# EAGLE design giraffe20_flipped (EAGLE 9.2.1)
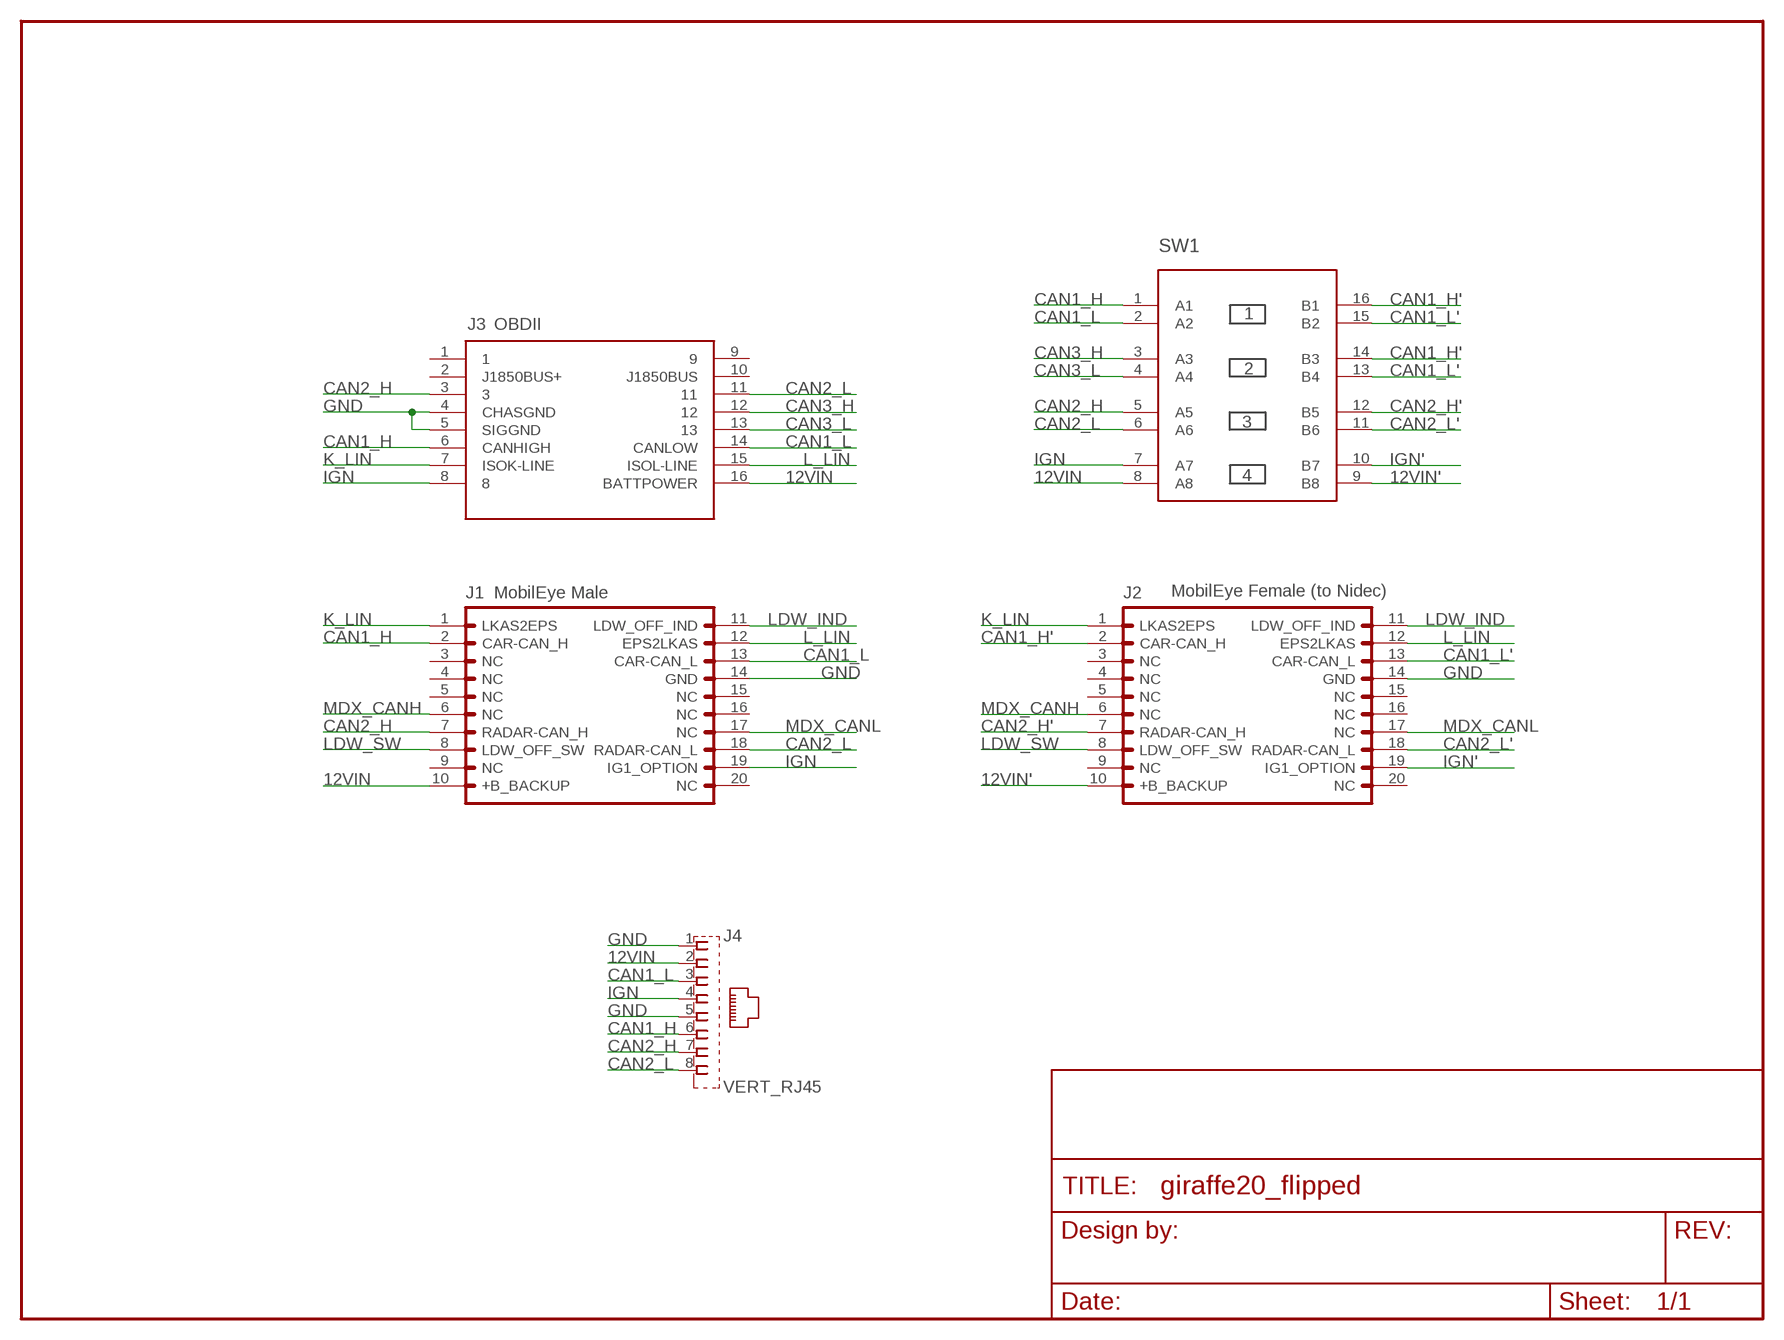
[diagram p0: schematic, sheet 1]

## Parts
FRAME1  FRAME-LETTERNO_PACKAGE  [DUMMY]
J1  MOBILEYERAMALE  [2X10(RA)]
J2  MOBILEYEFEMALE  [2X10(JAE_FEMALE)]
J3  OBDII-FEMALE-CUT  [OBDII-FEMALE-MIDCUT]
J4  VERT_RJ45  [GLX-S-88M]
SW1  4XDPSTSMT  [4-DPST]

## Nets
12VIN: J1.10(+B_BACKUP) J3.16(BATTPOWER) J4.2 SW1.8(A8)
12VIN': J2.10(+B_BACKUP) SW1.9(B8)
CAN1_H: J1.2(CAR-CAN_H) J3.6(CANHIGH) J4.6 SW1.1(A1)
CAN1_H': J2.2(CAR-CAN_H) SW1.14(B3) SW1.16(B1)
CAN1_L: J1.13(CAR-CAN_L) J3.14(CANLOW) J4.3 SW1.2(A2)
CAN1_L': J2.13(CAR-CAN_L) SW1.13(B4) SW1.15(B2)
CAN2_H: J1.7(RADAR-CAN_H) J3.3 J4.7 SW1.5(A5)
CAN2_H': J2.7(RADAR-CAN_H) SW1.12(B5)
CAN2_L: J1.18(RADAR-CAN_L) J3.11 J4.8 SW1.6(A6)
CAN2_L': J2.18(RADAR-CAN_L) SW1.11(B6)
CAN3_H: J3.12 SW1.3(A3)
CAN3_L: J3.13 SW1.4(A4)
GND: J1.14(GND) J2.14(GND) J3.4(CHASGND) J3.5(SIGGND) J4.1 J4.5
IGN: J1.19(IG1_OPTION) J3.8 J4.4 SW1.7(A7)
IGN': J2.19(IG1_OPTION) SW1.10(B7)
K_LIN: J1.1(LKAS2EPS) J2.1(LKAS2EPS) J3.7(ISOK-LINE)
L_LIN: J1.12(EPS2LKAS) J2.12(EPS2LKAS) J3.15(ISOL-LINE)
LDW_IND: J1.11(LDW_OFF_IND) J2.11(LDW_OFF_IND)
LDW_SW: J1.8(LDW_OFF_SW) J2.8(LDW_OFF_SW)
MDX_CANH: J1.6(NC) J2.6(NC)
MDX_CANL: J1.17(NC) J2.17(NC)
Unconnected: J1.3(NC) J1.4(NC) J1.5(NC) J1.9(NC) J1.15(NC) J1.16(NC) J1.20(NC) J2.3(NC) J2.4(NC) J2.5(NC) J2.9(NC) J2.15(NC) J2.16(NC) J2.20(NC) J3.1 J3.2(J1850BUS+) J3.9 J3.10(J1850BUS)

## Notes on the sheet
- OBDII
- MobilEye Male | MobilEye Female (to Nidec)

## Library data of the parts
FRAME1 = SparkFun-Aesthetics:FRAME-LETTER: Schematic Frame Standard 8.5x11 US Letter frame; DESIGNER: Nobody; VERSION: v01
J1 J2 = comma.ai:MOBILEYE: MobileEye connector for Acura ILX
J3 = comma.ai:OBDII-FEMALE
J4 = comma.ai:VERT_RJ45: Mod. Jack, Right Angle, 8 posiotion, 8 contatcs RJ45 Source: GLX-S-88M.pdf; OC_FARNELL: unknown; OC_NEWARK: unknown
SW1 = comma.ai:4XDPST

## Net classes
1 data: width 0.254 mm, clearance 0.254 mm

## Board
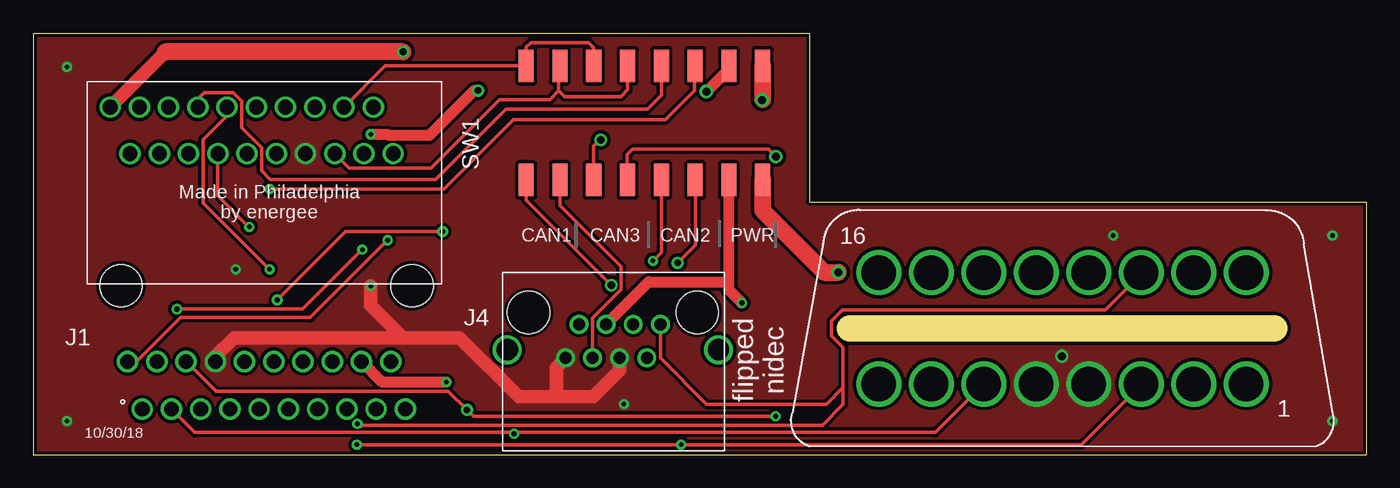
[diagram p1: board, top side]
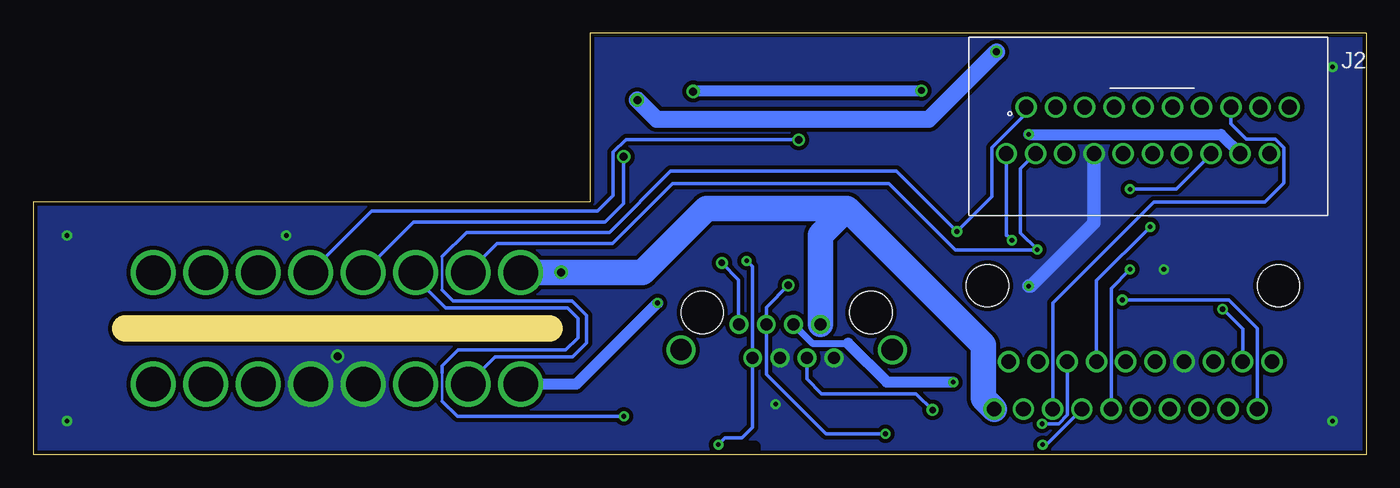
[diagram p2: board, bottom side, seen from below]

Size 100.33 x 31.75 mm. Coordinates in mm from the lower left corner, seen from the top.
Outline: 61.47,9.53 93.4,9.53
Outline: 0,31.75 58.42,31.75 58.42,19.05 100.33,19.05 100.33,0 0,0 0,31.75
Copper layers (1*16): Top 0.035mm / dielectric 1.5mm / Bottom 0.035mm
Design rules "default *": minimum track width 6mil, minimum drill 10mil, track to track 6mil, track to pad 6mil, pad to pad 6mil, via to via 6mil, smd to smd 6mil, copper to edge 10mil, drill to drill 10mil, minimum pad ring 10mil, minimum via ring 8mil, stop-mask expansion 4mil, vias tented up to drill 100mil, thermal gap 10mil
bRestrict: area 46,0.2 to 46.8,0.6

### Footprints (pad centres in the part's own frame; a part is rotated, then mirrored left to right if it is on the bottom)
2X10(RA) = drill 1.1 pad 1.422: 1 9.83,1.83; 2 7.63,1.83; 3 5.43,1.83; 4 3.23,1.83; 5 1.03,1.83; 6 -1.17,1.83; 7 -3.37,1.83; 8 -5.57,1.83; 9 -7.77,1.83; 10 -9.97,1.83; 11 10.93,-1.77; 12 8.73,-1.77; 13 6.53,-1.77; 14 4.33,-1.77; 15 2.13,-1.77; 16 -0.07,-1.77; 17 -2.27,-1.77; 18 -4.47,-1.77; 19 -6.67,-1.77; 20 -8.87,-1.77 | hole 3.2: -10.47,-7.47; 11.43,-7.47
2X10(JAE_FEMALE) = drill 1.1 pad 1.422: 1 -8.7,1.75; 2 -6.5,1.75; 3 -4.3,1.75; 4 -2.1,1.75; 5 0.1,1.75; 6 2.3,1.75; 7 4.5,1.75; 8 6.7,1.75; 9 8.9,1.75; 10 11.1,1.75; 11 -10.2,-1.75; 12 -8,-1.75; 13 -5.8,-1.75; 14 -3.6,-1.75; 15 -1.4,-1.75; 16 0.8,-1.75; 17 3,-1.75; 18 5.2,-1.75; 19 7.4,-1.75; 20 9.6,-1.75
OBDII-FEMALE-MIDCUT = drill 2.6 pad 3.4: 1 13.825,-4.2; 2 9.875,-4.2; 3 5.925,-4.2; 4 1.975,-4.2; 5 -1.975,-4.2; 6 -5.925,-4.2; 7 -9.875,-4.2; 8 -13.825,-4.2; 9 13.825,4.2; 10 9.875,4.2; 11 5.925,4.2; 12 1.975,4.2; 13 -1.975,4.2; 14 -5.925,4.2; 15 -9.875,4.2; 16 -13.825,4.2
GLX-S-88M = drill 0.9 pad 1.422: 1 -3.66,1.57; 2 -2.64,4.11; 3 -1.62,1.57; 4 -0.6,4.11; 5 0.42,1.57; 6 1.44,4.11; 7 2.46,1.57; 8 3.48,4.11 | drill 1.6 pad 2.184: S1 -8.04,2.2; S2 7.86,2.2 | hole 3.2: -6.44,5; 6.26,5
4-DPST = smd 1.13 x 2.44: 1 -8.89,-4.3; 2 -6.35,-4.3; 3 -3.81,-4.3; 4 -1.27,-4.3; 5 1.27,-4.3; 6 3.81,-4.3; 7 6.35,-4.3; 8 8.89,-4.3; 9 8.89,4.3; 10 6.35,4.3; 11 3.81,4.3; 12 1.27,4.3; 13 -1.27,4.3; 14 -3.81,4.3; 15 -6.35,4.3; 16 -8.89,4.3

### Placement (x,y rotation side)
FRAME1  -1.27,-12.7 0 top  (outside the outline)
J1  18.03,5.26 180 top
J2  16.89,24.43 0 bottom
J3  77.47,9.53 0 top
J4  43.72,5.71 0 top
SW1  46,24.99 0 top

### Tracks (layer width: path | path; a pad name or v marks a point on that pad's centre or on a via)
12VIN  (via drill 0.6)
  Top 1.27: SW1.8 54.89,18.4 59.55,13.74 v60.59,13.74
  Bottom 1.905: J1.10 28.81,4.24 28.81,8.26 39.09,18.54 | 39.09,18.54 49.66,18.54 54.46,13.74 v60.59,13.74 63.63,13.74 J3.16 | 39.09,18.54 41.08,16.55 J4.2
12VIN'  (via drill 0.5, 0.6)
  Top 0.813: 54.89,26.75 v54.86,26.72
  Top 1.016: 9.96,30.35 J2.10
  Top 1.27: SW1.9 54.89,26.75 | v27.84,30.35 9.96,30.35
  Bottom 1.27: v54.86,26.72 53.42,25.27 32.92,25.27 v27.84,30.35
CAN1_H  (via drill 0.35, 0.55)
  Top 0.254: SW1.1 37.11,19.18 v43.5,12.79 v43.5,12.78 | J3.6 67.9,1.68 36.29,1.68 | J1.2 12.15,1.68 36.29,1.68 | v36.2,1.58 36.29,1.68
  Bottom 0.254: v43.5,12.78 45.16,11.11 J4.6 45.16,6.07 40.67,1.58 v36.2,1.58
CAN1_H'
  Top 0.254: SW1.14 42.19,30.66 41.81,31.04 37.47,31.04 37.11,30.68 SW1.16 26.5,29.29 J2.2
CAN1_L  (via drill 0.35, 0.5 pad 0.55)
  Top 0.254: SW1.2 39.65,18.77 44.26,14.16 44.26,12.46 42.1,10.31 J4.3 | J1.13 13.76,4.78 31.24,4.78 v32.64,3.38 33.12,2.89 v55.88,2.89
  Bottom 0.203: 69.55,6.17 69.55,6.14 69.55,6.13 69.55,4.52 69.55,4.51 69.55,4.04
  Bottom 0.254: J3.14 71.55,13.32 69.28,11.05 60.1,11.05 59.33,10.29 59.33,8.81 60.25,7.9 68.35,7.9 69.55,6.71 69.55,6.17 | 69.55,4.04 68.4,2.9 v55.88,2.9 v55.88,2.89 | v32.64,3.38 32.66,3.38 33.88,4.6 41,4.6 42.11,5.71 42.11,7.27 J4.3
CAN1_L'
  Top 0.254: 39.55,27.41 38.9,26.76 35.1,26.76 29.93,21.59 23.79,21.59 J2.13 | 39.55,27.41 39.55,29.19 SW1.15 | SW1.13 44.73,27.48 44.22,26.98 39.98,26.98 39.55,27.41
CAN2_H  (via drill 0.35)
  Top 0.254: v24.36,0.76 v48.77,0.76 78.89,0.76 83.39,5.26 J3.3 | SW1.5 47.27,15.24 v46.63,14.61
  Bottom 0.254: v46.63,14.61 46.2,14.17 46.2,7.31 J4.7 46.18,2.08 46.99,1.27 48.26,1.27 v48.77,0.76 | v24.36,0.76 24.07,0.76 J1.7
CAN2_H'
  Top 0.254: SW1.12 47.27,27.08 46.23,26.04 35.59,26.04 30.28,20.73 17.85,20.73 17.17,21.4 17.17,23.13 15.67,24.63 15.67,26.63 15.04,27.27 12.87,27.27 12.39,26.79 J2.7
CAN2_L  (via drill 0.35, 0.5)
  Top 0.254: v48.5,14.45 49.84,15.79 49.84,20.67 SW1.6 | J3.11 83.39,13.61 80.69,10.9 60.9,10.9 60.09,10.1 60.09,8.95 60.96,8.08 60.96,5.08 | 60.96,5.08 60.96,3.81 59.38,2.23 24.74,2.23 24.66,2.16 24.49,2.33 v24.4,2.33 | J4.8 47.2,7.29 50.67,3.81 59.69,3.81 60.96,5.08
  Bottom 0.254: J4.8 47.23,9.86 47.23,13.18 v48.5,14.45 | v24.4,2.33 24.39,2.34 23.16,2.34 22.5,3 J1.18
CAN2_L'  (via drill 0.35)
  Top 0.254: SW1.11 49.78,27.43 47.6,25.25 36.17,25.25 30.92,20 v17.78,20
  Bottom 0.254: v17.78,20 14.29,20 11.69,22.6 J2.18
CAN3_H  (via drill 0.55)
  Top 0.254: v42.72,23.72 42.69,23.72 42.19,23.23 SW1.3
  Bottom 0.254: J3.12 79.44,13.76 74.85,18.35 57.85,18.35 56.67,19.52 56.67,22.78 55.73,23.72 v42.72,23.72
CAN3_L  (via drill 0.6)
  Top 0.254: v55.89,22.45 55.33,23.01 45.11,23.01 44.7,22.61 44.7,20.72 SW1.4
  Bottom 0.254: J3.13 71.69,17.53 57.28,17.53 55.89,18.91 v55.89,22.45
GND  (via drill 0.35, 0.6)
  Top 1.016: J1.14 13.7,7.41 15.11,8.81 27.84,8.81 | 27.84,8.81 32.11,8.81 36.57,4.35 39.37,4.35 | 39.37,4.35 42.14,4.35 44.14,6.35 J4.5 | 39.37,4.35 39.37,6.59 J4.1 | 27.84,8.81 25.4,11.25 v25.4,12.7
  Bottom 1.016: J2.14 20.49,17.46 25.25,12.7 v25.4,12.7
  other vias: 77.42,7.42 2.54,2.54 81.28,16.51 15.24,13.97 44.45,3.81 2.54,29.21 97.79,2.54 97.79,16.51
  pour Top (isolate 0.254, no thermals): 0,31.75 0,0 100.33,0 100.33,19.05 58.42,19.05 58.42,31.75
  pour Bottom (isolate 0.305, no thermals): -0.05,31.8 58.42,31.8 58.42,19 100.3,19 100.3,0 -0.05,0
IGN  (via drill 0.35)
  Top 0.813: v53.34,11.43 52.35,12.42 52.35,13.03 | 52.35,13.03 SW1.7 | J4.4 46.33,13.03 52.35,13.03 | v31.09,5.46 26.27,5.46 J1.19
  Bottom 0.508: J4.4 41.7,8.4 39.01,8.4
  Bottom 0.813: J3.8 59.45,5.33 v53.34,11.43 | 39.01,8.4 36.09,5.49 31.11,5.49 v31.09,5.46
IGN'  (via drill 0.35, 0.5, 0.6)
  Top 0.813: SW1.10 52.35,29.05 v50.66,27.36 | v33.48,27.43 33.19,27.43 29.8,24.05 26.75,24.05 26.67,24.13 v25.4,24.13
  Bottom 0.813: v50.66,27.36 50.58,27.43 v33.48,27.43 | v25.4,24.13 10.94,24.13 J2.19
K_LIN  (via drill 0.4)
  Top 0.254: v30.81,16.82 23.52,16.82 v18.36,11.66
  Bottom 0.203: 69.55,14.92 69.55,14.54 69.55,14.53 69.55,12.39
  Bottom 0.254: 69.55,14.92 67.73,16.74 56.97,16.74 52.36,21.35 35.34,21.35 v30.81,16.82 28.17,19.45 28.17,23.13 25.59,25.72 J2.1 | J1.1 8.2,9.5 10.36,11.66 v18.36,11.66 | 69.55,12.39 68.74,11.58 59.77,11.58 58.67,10.49 58.67,8.43 59.74,7.37 65.55,7.37 J3.7
L_LIN  (via drill 0.35, 0.4)
  Top 0.254: v24.77,15.45 20.29,10.97 v10.81,10.97
  Bottom 0.254: J3.15 65.42,15.9 56.72,15.9 52.2,20.42 35.94,20.42 30.94,15.42 24.79,15.42 v24.77,15.45 26.04,16.72 26.04,21.54 J2.12 | v10.81,10.97 9.3,9.47 J1.12
LDW_IND  (via drill 0.35)
  Top 0.254: v26.67,16.16 20.85,10.34 11.08,10.34 7.77,7.03 J1.11
  Bottom 0.254: J2.11 27.09,16.51 27.02,16.51 v26.67,16.16
LDW_SW
  Bottom 0.254: J1.8 23.6,11.42 15.98,19.05 7.62,19.05 6.21,20.46 6.21,23.13 6.84,23.77 9.02,23.77 10.19,24.94 J2.8
MDX_CANH  (via drill 0.35)
  Top 0.254: J2.6 14.59,25.55 12.79,23.75 12.79,18.96 v17.78,13.97
  Bottom 0.254: J1.6 19.2,12.53 17.78,13.96 v17.78,13.97
MDX_CANL  (via drill 0.35)
  Top 0.254: v16.26,17.17 16.23,17.17 13.89,19.51 J2.17
  Bottom 0.254: J1.17 20.3,13.13 v16.26,17.17

### Text on the board
tPlace: Made in Philadelphia / by energee | CAN1 | CAN3 | CAN2 | PWR | flipped / nidec | 10/30/18
Document: *compatible with freeTheC pins soldered on TOP